# Altium schematic sheet Sensores.SchDoc
size A4
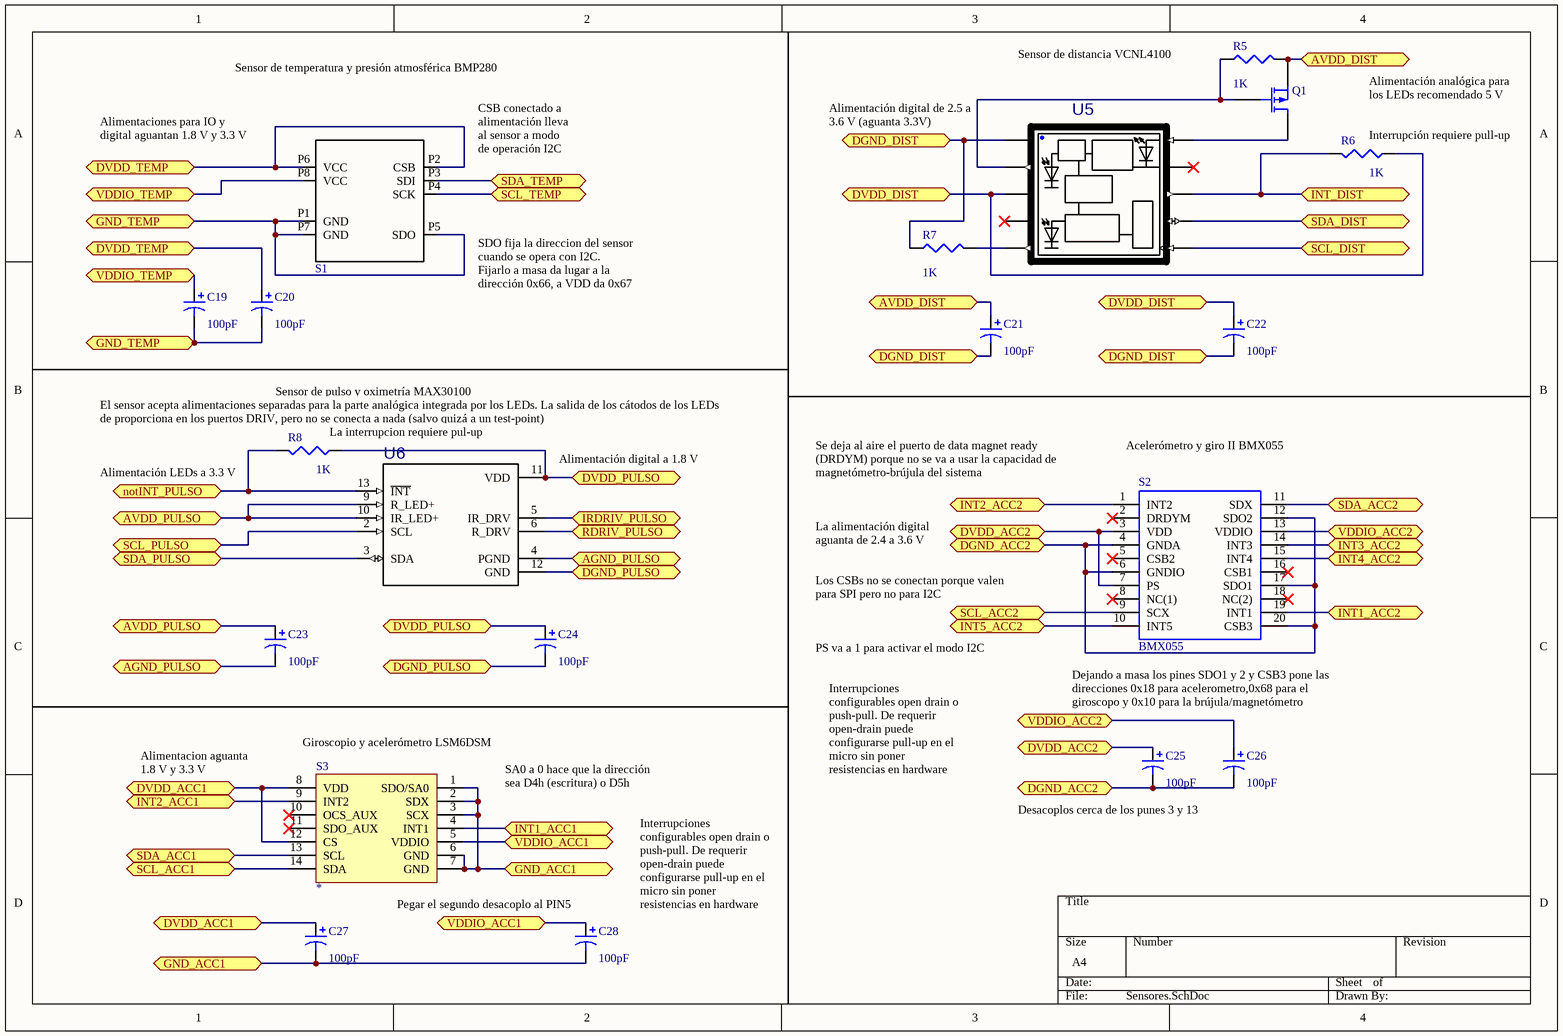
[diagram p0: Sensores.SchDoc]

## Parts
C19  value 100pF  [C0805]
C20  value 100pF  [C0805]
C21  value 100pF  [C0805]
C22  value 100pF  [C0805]
C23  value 100pF  [C0805]
C24  value 100pF  [C0805]
C25  value 100pF  [C0805]
C26  value 100pF  [C0805]
C27  value 100pF  [C0805]
C28  value 100pF  [C0805]
Q1  (no value)  [E3]
R5  value 1K  [J1-0603]
R6  value 1K  [J1-0603]
R7  value 1K  [J1-0603]
R8  value 1K  [J1-0603]
S1  *  [LGA-8_BMP280(Primary)]  (value not drawn)
S2  BMX055  [LGA_PACKAGE_20_PINS]
S3  *  [LGA14R50P5X4_300X250X83]
U5  VCNL4100  [VISHAY_VCNL4100_8X3X1.8]  (value not drawn)
U6  MAX30100EFD+  [LGA14R80P2X7_560X280X130]  (value not drawn)

## Ports
AGND_PULSO, AVDD_DIST, AVDD_PULSO, DGND_ACC2, DGND_DIST, DGND_PULSO, DVDD_ACC1, DVDD_ACC2, DVDD_DIST, DVDD_PULSO, DVDD_TEMP, GND_ACC1, GND_TEMP, INT1_ACC1, INT1_ACC2, INT2_ACC1, INT2_ACC2, INT3_ACC2, INT4_ACC2, INT5_ACC2, INT_DIST, IRDRIV_PULSO, notINT_PULSO, RDRIV_PULSO, SCL_ACC1, SCL_ACC2, SCL_DIST, SCL_PULSO, SCL_TEMP, SDA_ACC1, SDA_ACC2, SDA_DIST, SDA_PULSO, SDA_TEMP, VDDIO_ACC1, VDDIO_ACC2, VDDIO_TEMP

## Nets
AGND_PULSO: C23.2 U6.4(PGND) ; port AGND_PULSO
AVDD_DIST: C21.1 Q1.3(S) R5.2 ; port AVDD_DIST
AVDD_PULSO: C23.1 U6.9(R_LED+) U6.10(IR_LED+) ; port AVDD_PULSO
DGND_ACC2: C25.2 C26.2 S2.4(GNDA) S2.6(GNDIO) S2.12(SDO2) S2.17(SDO1) S2.20(CSB3) ; port DGND_ACC2
DGND_DIST: C21.2 C22.2 R7.1 U5.1(GND) ; port DGND_DIST
DGND_PULSO: C24.2 U6.12(GND) ; port DGND_PULSO
DVDD_ACC1: C27.1 S3.8(VDD) S3.12(CS) ; port DVDD_ACC1
DVDD_ACC2: C25.1 S2.3(VDD) S2.7(PS) ; port DVDD_ACC2
DVDD_DIST: C22.1 R6.1 U5.3(VDD) ; port DVDD_DIST
DVDD_PULSO: C24.1 R8.1 U6.11(VDD) ; port DVDD_PULSO
DVDD_TEMP: C20.1 S1.P2(CSB) S1.P6(VCC) ; port DVDD_TEMP
GND_ACC1: C27.2 C28.2 S3.1(SDO/SA0) S3.2(SDX) S3.3(SCX) S3.6(GND) S3.7(GND) ; port GND_ACC1
GND_TEMP: C19.2 C20.2 S1.P1(GND) S1.P5(SDO) S1.P7(GND) ; port GND_TEMP
INT1_ACC1: S3.4(INT1) ; port INT1_ACC1
INT1_ACC2: S2.19(INT1) ; port INT1_ACC2
INT2_ACC1: S3.9(INT2) ; port INT2_ACC1
INT2_ACC2: S2.1(INT2) ; port INT2_ACC2
INT3_ACC2: S2.14(INT3) ; port INT3_ACC2
INT4_ACC2: S2.15(INT4) ; port INT4_ACC2
INT5_ACC2: S2.10(INT5) ; port INT5_ACC2
INT_DIST: R6.2 U5.8(INT) ; port INT_DIST
IRDRIV_PULSO: U6.5(IR_DRV) ; port IRDRIV_PULSO
notINT_PULSO: R8.2 U6.13(~{INT}) ; port notINT_PULSO
RDRIV_PULSO: U6.6(R_DRV) ; port RDRIV_PULSO
SCL_ACC1: S3.14(SDA) ; port SCL_ACC1
SCL_ACC2: S2.9(SCX) ; port SCL_ACC2
SCL_DIST: U5.10(SCLK) ; port SCL_DIST
SCL_PULSO: U6.2(SCL) ; port SCL_PULSO
SCL_TEMP: S1.P4(SCK) ; port SCL_TEMP
SDA_ACC1: S3.13(SCL) ; port SDA_ACC1
SDA_ACC2: S2.11(SDX) ; port SDA_ACC2
SDA_DIST: U5.9(SDAT) ; port SDA_DIST
SDA_PULSO: U6.3(SDA) ; port SDA_PULSO
SDA_TEMP: S1.P3(SDI) ; port SDA_TEMP
VDDIO_ACC1: C28.1 S3.5(VDDIO) ; port VDDIO_ACC1
VDDIO_ACC2: C26.1 S2.13(VDDIO) ; port VDDIO_ACC2
VDDIO_TEMP: C19.1 S1.P8(VCC) ; port VDDIO_TEMP
NetQ1_1: Q1.1(D) U5.6(LED+)
NetQ1_2: Q1.2(G) R5.1 U5.2(LED-C)
NetR7_2: R7.2 U5.5(LED-)

Not connected (* = marked no-connect by the designer): S2 2(DRDYM)* 5(CSB2)* 8(NC(1))* 16(CSB1)* 18(NC(2))*; S3 10(OCS_AUX)* 11(SDO_AUX)*; U5 4(NC)* 7(NC2)*

## Notes on the sheet
- Sensor de temperatura y presión atmosférica BMP280
- (near R5) Sensor de distancia VCNL4100
- Alimentación analógica para los LEDs recomendado 5 V
- Alimentaciones para IO y digital aguantan 1.8 V y 3.3 V
- CSB conectado a alimentación lleva al sensor a modo de operación I2C
- Alimentación digital de 2.5 a 3.6 V (aguanta 3.3V)
- (near R6) Interrupción requiere pull-up
- SDO fija la direccion del sensor cuando se opera con I2C.
  Fijarlo a masa da lugar a la dirección 0x66, a VDD da 0x67
- (near R8) El sensor acepta alimentaciones separadas para la parte analógica integrada por los LEDs. La salida de los cátodos de los LEDs de proporciona en los puertos DRIV, pero no se conecta a nada (salvo quizá a un test-point)
- Sensor de pulso y oximetría MAX30100
- (near R8) La interrupcion requiere pul-up
- Acelerómetro y giro II BMX055
- (near R8) Alimentación LEDs a 3.3 V
- (near U6) Alimentación digital a 1.8 V
- Se deja al aire el puerto de data magnet ready (DRDYM) porque no se va a usar la capacidad de magnetómetro-brújula del sistema
- La alimentación digital aguanta de 2.4 a 3.6 V
- Los CSBs no se conectan porque valen para SPI pero no para I2C
- PS va a 1 para activar el modo I2C
- Dejando a masa los pines SDO1 y 2 y CSB3 pone las direcciones 0x18 para acelerometro,0x68 para el giroscopo y 0x10 para la brújula/magnetómetro
- Alimentacion aguanta 1.8 V y 3.3 V
- (near S3) Giroscopio y acelerómetro LSM6DSM
- SA0 a 0 hace que la dirección sea D4h (escritura) o D5h (lectura)
- Interrupciones configurables open drain o push-pull. De requerir open-drain puede configurarse pull-up en el micro sin poner resistencias en hardware
- Desacoplos cerca de los punes 3 y 13
- (near C28) Pegar el segundo desacoplo al PIN5

## Library data of the parts
C19-C28 = Cap Pol3: Polarized Capacitor (Surface Mount); Published: 8-Jun-2000; LatestRevisionDate: 29-May-2009; LatestRevisionNote: IPC-7351 Footprint Added.; PackageReference: C0805; Publisher: Altium Limited; PackageDescription: Chip Capacitor
Q1 = MOSFET-P: P-Channel MOSFET; Published: 8-Jun-2000; LatestRevisionDate: 17-Jul-2002; LatestRevisionNote: Re-released for DXP Platform.; PackageVersion: 1995/1996; PackageReference: E3; Publisher: Altium Limited; PackageDescription: TO, Flat Index; 3 In-Line, Axial Leads; Body Dia. 4.6mm; Lead Dia. 0.5 mm (max)
R5-R8 = Res3: Resistor; Published: 8-Jun-2000; LatestRevisionDate: 29-May-2009; LatestRevisionNote: IPC-7351 Footprint Added.; PackageReference: J1-0603; Publisher: Altium Limited; PackageDescription: Chip Resistor
S1 = BMP280: BMP280 Absolute Barometric Pressure Sensor for Battery Powered Devices 2 x 2.5mm; MF: Bosch; MP: BMP280; Price: 2.16 USD; Package: None; Availability: Good; Value: *
S2 = BMX055: Small versatile 9-axis sensor module; Manufacturer_Name: Bosch Sensortec; Supplier_Name: RS; RS Part Number: *; Manufacturer_Part_Number: BMX055; Datasheet Link: http://www.mouser.com/ds/2/621/BST-BMX055-DS000-02-586421.pdf; Height: mm; Allied_Number: *; 3D Package: *; Other Part Number: *
S3 = LSM6DSMTR: Small versatile 6-axis acc&gyro
U5 = VCNL4100: High Sensitivity Long Distance Proximity Sensor. Dimensions (L x W x H in mm): 8; MF: Vishay; Availability: Good; MP: VCNL4100; Price: 3.52 USD; Package: None; Value: *
U6 = MAX30100EFD+: Pulse Oximeter and Heart-Rate Sensor IC 14-Pin OLGA; MF: Maxim Integrated; Availability: Good; MP: MAX30100EFD+; Price: 4.00 USD; Package: None; Value: *